# Altium project segment_driver_large.PrjPcb
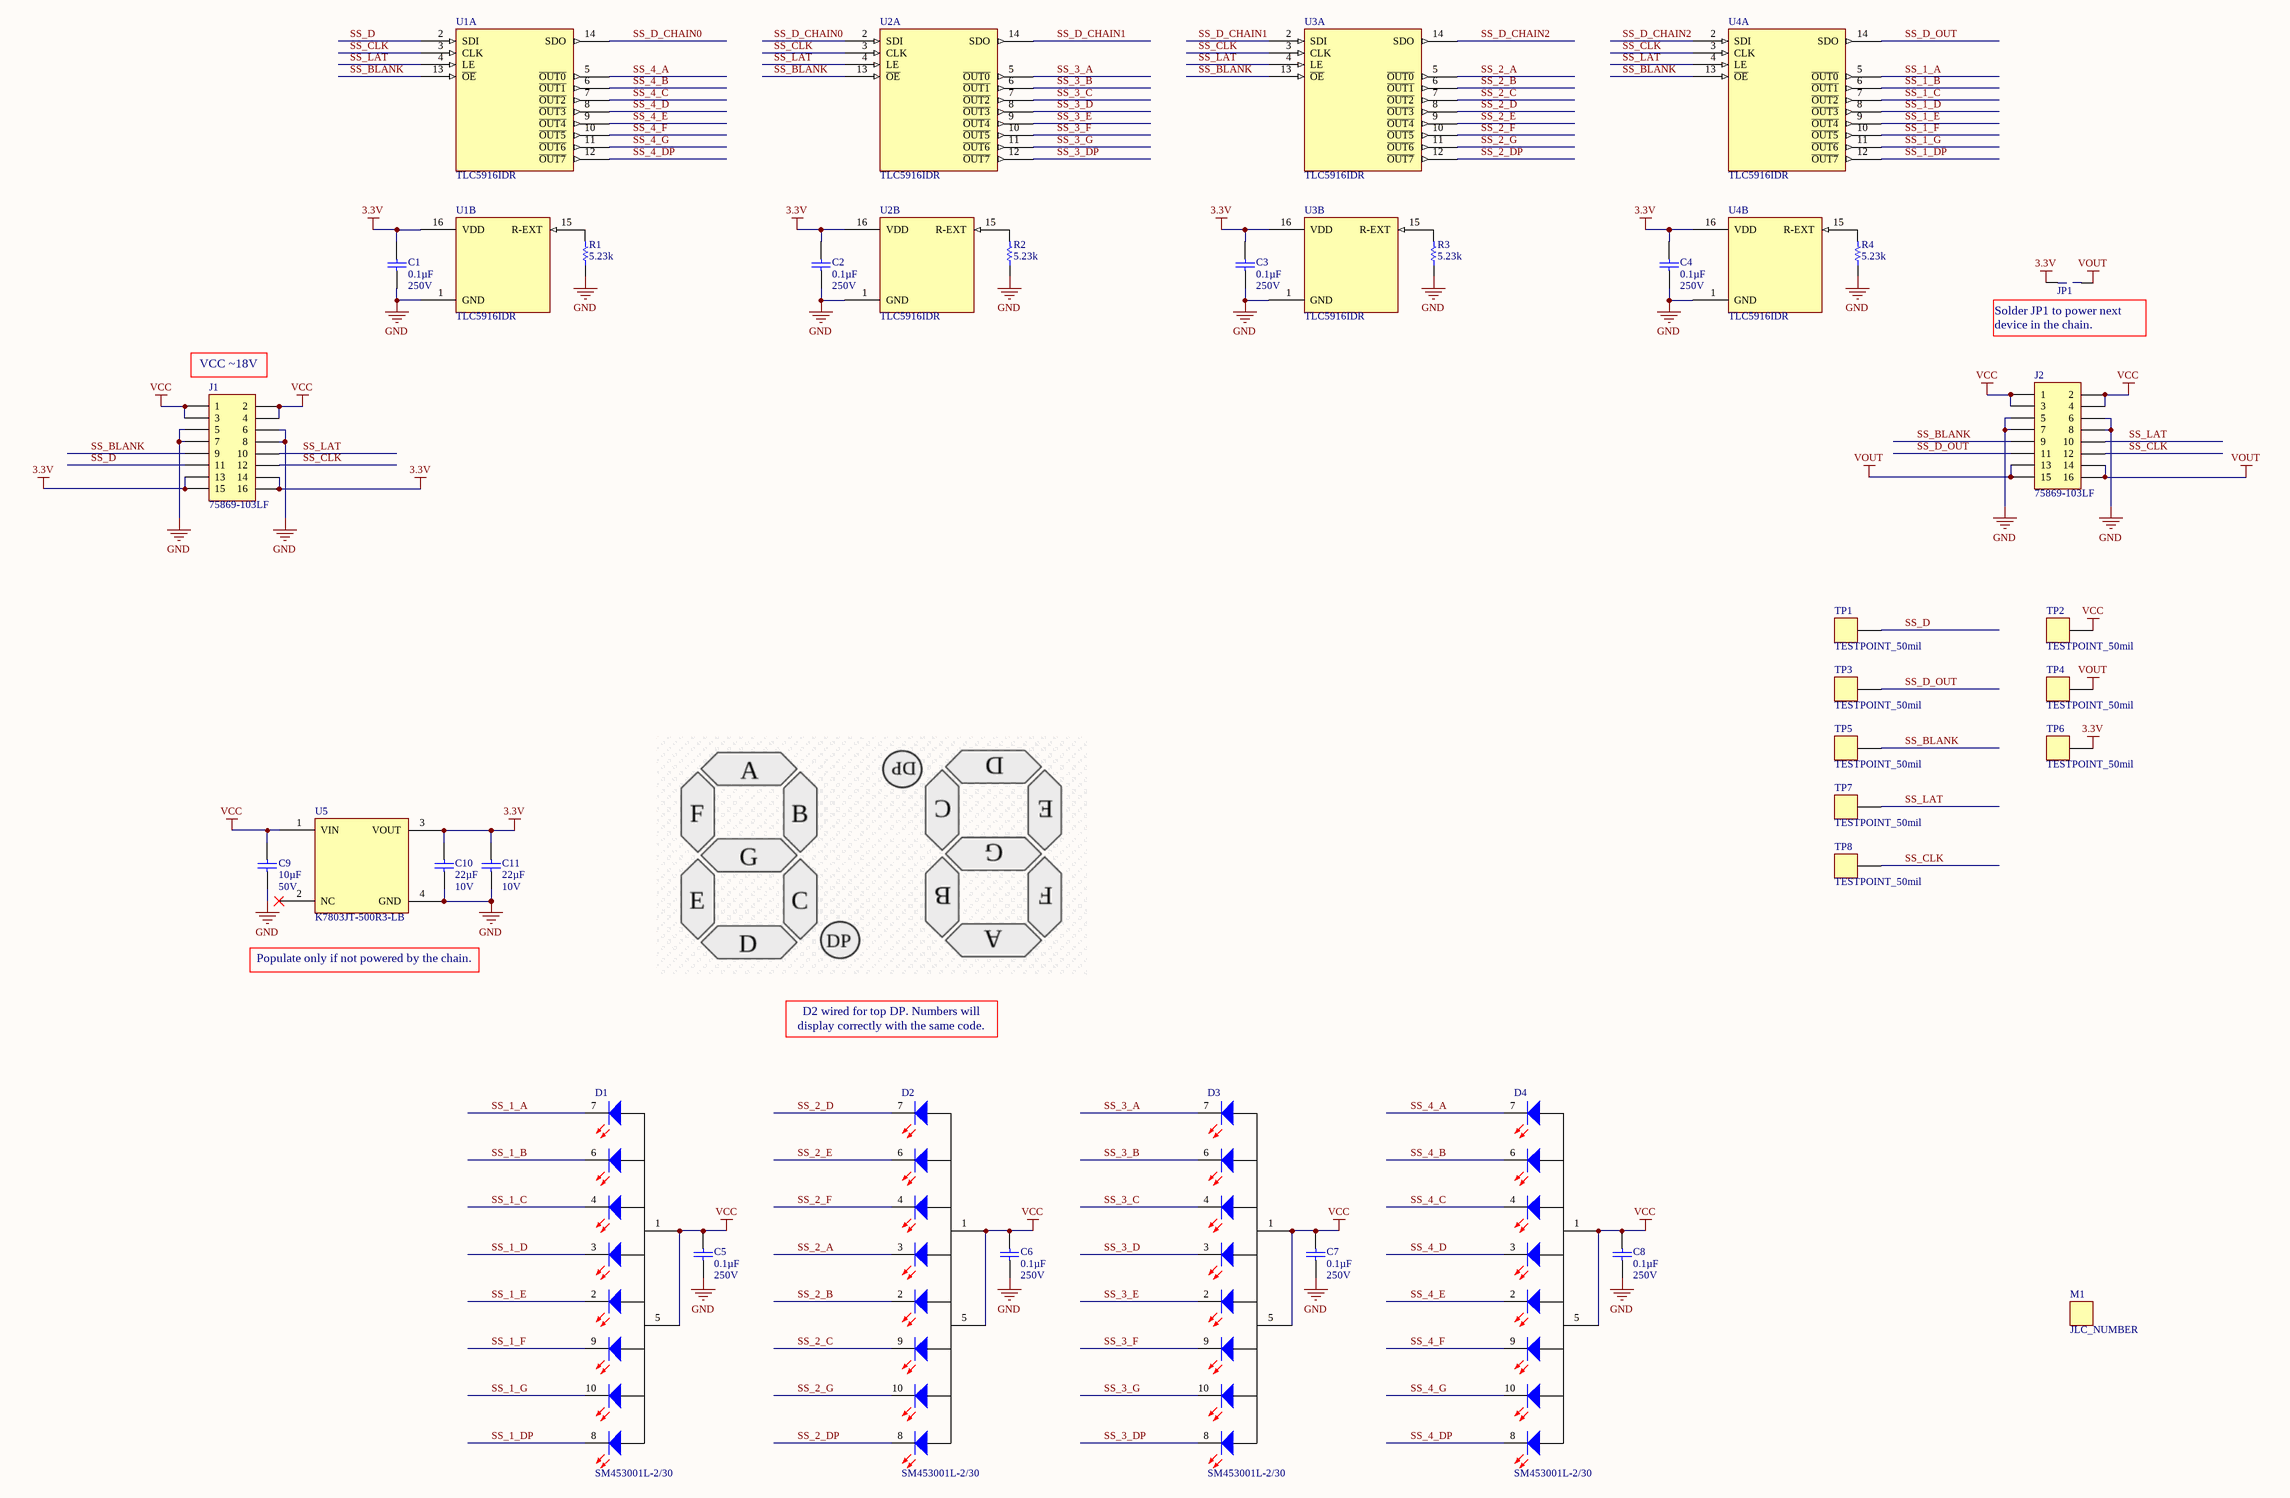
[diagram p0: segment_driver_large.SchDoc]
LeadEngineer: JCF; HardRev: A; Codename: 3 Inch Segment Driver; BOMRev: A
1 sheet, 36 parts. Net scope: global (net labels, ports and power ports of the same name join across sheets).
Board file: segment_driver_large.PcbDoc

## Sheet segment_driver_large.SchDoc
size C; SheetNumber: 1; SheetTotal: 1

### Parts
C1  0.1µF  Voltage: 250V  [Chip0805]
C2  0.1µF  Voltage: 250V  [Chip0805]
C3  0.1µF  Voltage: 250V  [Chip0805]
C4  0.1µF  Voltage: 250V  [Chip0805]
C5  0.1µF  Voltage: 250V  [Chip0805]
C6  0.1µF  Voltage: 250V  [Chip0805]
C7  0.1µF  Voltage: 250V  [Chip0805]
C8  0.1µF  Voltage: 250V  [Chip0805]
C9  10µF  Voltage: 50V  [Chip1206]
C10  22µF  Voltage: 10V  [Chip0805]
C11  22µF  Voltage: 10V  [Chip0805]
D1  SM453001L-2/30  [ARKLED_SM453001L]
D2  SM453001L-2/30  [ARKLED_SM453001L]
D3  SM453001L-2/30  [ARKLED_SM453001L]
D4  SM453001L-2/30  [ARKLED_SM453001L]
J1  75869-103LF  [IDC_100_2x8]
J2  75869-103LF  [IDC_100_2x8]
JP1  JUMMPER_NO_CIRCLE  [JUMMPER_NO_CIRCLE]  (value not drawn)  (no BOM)
M1  JLC_NUMBER  [JLC_NUMBER]  (no BOM)
R1  5.23k  [Chip0805]
R2  5.23k  [Chip0805]
R3  5.23k  [Chip0805]
R4  5.23k  [Chip0805]
TP1  TESTPOINT_50mil  [TESTPOINT_50mil]  (no BOM)
TP2  TESTPOINT_50mil  [TESTPOINT_50mil]  (no BOM)
TP3  TESTPOINT_50mil  [TESTPOINT_50mil]  (no BOM)
TP4  TESTPOINT_50mil  [TESTPOINT_50mil]  (no BOM)
TP5  TESTPOINT_50mil  [TESTPOINT_50mil]  (no BOM)
TP6  TESTPOINT_50mil  [TESTPOINT_50mil]  (no BOM)
TP7  TESTPOINT_50mil  [TESTPOINT_50mil]  (no BOM)
TP8  TESTPOINT_50mil  [TESTPOINT_50mil]  (no BOM)
U1  TLC5916IDR  [16-SOIC]  (parts A,B of 2)
U2  TLC5916IDR  [16-SOIC]  (parts A,B of 2)
U3  TLC5916IDR  [16-SOIC]  (parts A,B of 2)
U4  TLC5916IDR  [16-SOIC]  (parts A,B of 2)
U5  K7803JT-500R3-LB  [MORNSUN_K78XXJT-500R3-LB]

### Nets
3.3V: C1.2 C2.2 C3.2 C4.2 C10.2 C11.2 J1.13 J1.14 J1.15 J1.16 JP1.2 TP6.1 U1.16(VDD) U2.16(VDD) U3.16(VDD) U4.16(VDD) U5.3(VOUT)
GND: C1.1 C2.1 C3.1 C4.1 C5.1 C6.1 C7.1 C8.1 C9.1 C10.1 C11.1 J1.5 J1.6 J1.7 J1.8 J2.5 J2.6 J2.7 J2.8 R1.1 R2.1 R3.1 R4.1 U1.1(GND) U2.1(GND) U3.1(GND) U4.1(GND) U5.4(GND)
VCC: C5.2 C6.2 C7.2 C8.2 C9.2 D1.1(A) D1.5(A) D2.1(A) D2.5(A) D3.1(A) D3.5(A) D4.1(A) D4.5(A) J1.1 J1.2 J1.3 J1.4 J2.1 J2.2 J2.3 J2.4 TP2.1 U5.1(VIN)
VOUT: J2.13 J2.14 J2.15 J2.16 JP1.1 TP4.1
SS_1_A: D1.7(A) U4.5(~{OUT0})
SS_1_B: D1.6(B) U4.6(~{OUT1})
SS_1_C: D1.4(C) U4.7(~{OUT2})
SS_1_D: D1.3(D) U4.8(~{OUT3})
SS_1_DP: D1.8(DP) U4.12(~{OUT7})
SS_1_E: D1.2(E) U4.9(~{OUT4})
SS_1_F: D1.9(F) U4.10(~{OUT5})
SS_1_G: D1.10(G) U4.11(~{OUT6})
SS_2_A: D2.3(D) U3.5(~{OUT0})
SS_2_B: D2.2(E) U3.6(~{OUT1})
SS_2_C: D2.9(F) U3.7(~{OUT2})
SS_2_D: D2.7(A) U3.8(~{OUT3})
SS_2_DP: D2.8(DP) U3.12(~{OUT7})
SS_2_E: D2.6(B) U3.9(~{OUT4})
SS_2_F: D2.4(C) U3.10(~{OUT5})
SS_2_G: D2.10(G) U3.11(~{OUT6})
SS_3_A: D3.7(A) U2.5(~{OUT0})
SS_3_B: D3.6(B) U2.6(~{OUT1})
SS_3_C: D3.4(C) U2.7(~{OUT2})
SS_3_D: D3.3(D) U2.8(~{OUT3})
SS_3_DP: D3.8(DP) U2.12(~{OUT7})
SS_3_E: D3.2(E) U2.9(~{OUT4})
SS_3_F: D3.9(F) U2.10(~{OUT5})
SS_3_G: D3.10(G) U2.11(~{OUT6})
SS_4_A: D4.7(A) U1.5(~{OUT0})
SS_4_B: D4.6(B) U1.6(~{OUT1})
SS_4_C: D4.4(C) U1.7(~{OUT2})
SS_4_D: D4.3(D) U1.8(~{OUT3})
SS_4_DP: D4.8(DP) U1.12(~{OUT7})
SS_4_E: D4.2(E) U1.9(~{OUT4})
SS_4_F: D4.9(F) U1.10(~{OUT5})
SS_4_G: D4.10(G) U1.11(~{OUT6})
SS_BLANK: J1.9 J2.9 TP5.1 U1.13(~{OE}) U2.13(~{OE}) U3.13(~{OE}) U4.13(~{OE})
SS_CLK: J1.12 J2.12 TP8.1 U1.3(CLK) U2.3(CLK) U3.3(CLK) U4.3(CLK)
SS_D: J1.11 TP1.1 U1.2(SDI)
SS_D_CHAIN0: U1.14(SDO) U2.2(SDI)
SS_D_CHAIN1: U2.14(SDO) U3.2(SDI)
SS_D_CHAIN2: U3.14(SDO) U4.2(SDI)
SS_D_OUT: J2.11 TP3.1 U4.14(SDO)
SS_LAT: J1.10 J2.10 TP7.1 U1.4(LE) U2.4(LE) U3.4(LE) U4.4(LE)
NetR1_2: R1.2 U1.15(R-EXT)
NetR2_2: R2.2 U2.15(R-EXT)
NetR3_2: R3.2 U3.15(R-EXT)
NetR4_2: R4.2 U4.15(R-EXT)

Not connected (* = marked no-connect by the designer): U5 2(NC)*

### Notes on the sheet
- (near JP1) Solder JP1 to power next device in the chain.
- (near J1) VCC ~18V
- Populate only if not powered by the chain.
- D2 wired for top DP. Numbers will display correctly with the same code.
- Title:
- This work is licensed under a Creative Commons Attribution 4.0 International License. Derivative works should remove all Sophistry branding and ‘é’ watermark.
- Date:
- Engineer:
- Revision:
- Codename:
- Time:
- Variant:
- Sheet
- of

### Library data of the parts
C1-C8 = C2012X7T2E104K125AA: CAP CER 0.1UF 250V 10% X7T 0805; Manufacturer: TDK Corporation; PartNumber: C2012X7T2E104K125AA; HelpURL: http://product.tdk.com/capacitor/mlcc/en/documents/mlcc_commercial_midvoltage_en.pdf; Supplier 1: Digi-Key; Supplier Part Number 1: 445-7749-1-ND; Supplier 2: Mouser; Manufacturer Part Number: C2012X7T2E104K125AA; Series: C; Capacitance: 0.1µF; Tolerance: ±10%; Temperature Coefficient: X7T; Mounting Type: Surface Mount, MLCC; Operating Temperature: -55°C ~ 125°C; Applications: General Purpose; Ratings: -; Package / Case: 0805 (2012 Metric); Size / Dimension: 0.079" L x 0.049" W (2.00mm x 1.25mm); Height - Seated (Max): -; Thickness (Max): 0.057" (1.45mm); Lead Spacing: -; Features: -; Lead Style: -
C9 = C3216X5R1H106K160AB: CAP CER 10UF 50V 10% X5R 1206; Manufacturer: TDK Corporation; PartNumber: C3216X5R1H106K160AB; HelpURL: http://product.tdk.com/capacitor/mlcc/en/documents/mlcc_commercial_general_en.pdf; Supplier 1: Digi-Key; Supplier Part Number 1: 445-5998-1-ND; Supplier 2: Mouser; Manufacturer Part Number: C3216X5R1H106K160AB; Series: C; Capacitance: 10µF; Tolerance: ±10%; Temperature Coefficient: X5R; Mounting Type: Surface Mount, MLCC; Operating Temperature: -55°C ~ 85°C; Applications: General Purpose; Ratings: -; Package / Case: 1206 (3216 Metric); Size / Dimension: 0.126" L x 0.063" W (3.20mm x 1.60mm); Height - Seated (Max): -; Thickness (Max): 0.071" (1.80mm); Lead Spacing: -; Features: -; Lead Style: -
C10 C11 = C2012X5R1A226M085AC: CAP CER 22UF 10V 20% X5R 0805; Manufacturer: TDK Corporation; PartNumber: C2012X5R1A226M085AC; HelpURL: http://product.tdk.com/capacitor/mlcc/en/documents/mlcc_commercial_general_en.pdf; Supplier 1: Digi-Key; Supplier Part Number 1: 445-7663-1-ND; Supplier 2: Mouser; Manufacturer Part Number: C2012X5R1A226M085AC; Series: C; Capacitance: 22µF; Tolerance: ±20%; Temperature Coefficient: X5R; Mounting Type: Surface Mount, MLCC; Operating Temperature: -55°C ~ 85°C; Applications: General Purpose; Ratings: -; Package / Case: 0805 (2012 Metric); Size / Dimension: 0.079" L x 0.049" W (2.00mm x 1.25mm); Height - Seated (Max): -; Thickness (Max): 0.037" (0.95mm); Lead Spacing: -; Features: -; Lead Style: -
D1-D4 = SM453001L-2/30: SEGMENTS DISPLAY 3.0" COMMON ANODE; Manufacturer: ARKLED; PartNumber: SM453001L-2/30; Datasheets: https://www.lcsc.com/datasheet/lcsc_datasheet_2405201814_ARKLED-Wuxi-ARK-Tech-Elec-SM453001L-2-30_C164873.pdf; Supplier 1: Digi-Key; Supplier 2: Mouser; Supplier 3: LCSC; Supplier Part Number 3: C164873; Manufacturer Part Number: SM453001L-2/30
J1 J2 = 75869-103LF: CONN HEADER 16POS DUAL VERT PCB; Manufacturer: FCI; PartNumber: 75869-103LF; Supplier 1: Digi-Key; Supplier 2: Mouser; Supplier Part Number 2: 649-75869-103LF; HelpURL: http://portal.fciconnect.com/Comergent//fci/drawing/75869.pdf; Supplier Part Number 1: 609-1775-ND; Manufacturer Part Number: 75869-103LF
M1 = JLC_NUMBER: JLC Order Number Location; PartNumber: JLC_NUMBER; Manufacturer Part Number: JLC_NUMBER
R1-R4 = CRCW08055K23FKEA: RES 5.23K OHM 1/8W 1% 0805 SMD; Manufacturer: Vishay Dale; Power (Watts): 0.125W, 1/8W; Temperature Coefficient: ±100ppm/°C; PartNumber: CRCW08055K23FKEA; HelpURL: http://www.vishay.com/doc?20035; Supplier 1: Digi-Key; Supplier Part Number 1: 541-5.23KCCT-ND; Supplier 2: Mouser; Manufacturer Part Number: CRCW08055K23FKEA; Series: CRCW; Resistance: 5.23k; Tolerance: ±1%; Composition: Thick Film; Features: Automotive AEC-Q200 Qualified; Package / Case: 0805 (2012 Metric); Supplier Device Package: 0805 (2012 Metric); Size / Dimension: 0.079" L x 0.049" W (2.00mm x 1.25mm); Height: 0.020" (0.50mm); Number of Terminations: 2
U1-U4 = TLC5916IDR: IC LED DRVR LINEAR 120MA 16SOIC; Manufacturer: Texas Instruments; PartNumber: TLC5916IDR; Supplier 1: Digi-Key; Supplier 2: Mouser; Supplier Part Number 2: 595-TLC5916IDR; HelpURL: https://www.ti.com/lit/ds/symlink/tlc5916.pdf; Supplier Part Number 1: 296-22710-2-ND; Manufacturer Part Number: TLC5916IDR
U5 = K7803JT-500R3-LB: LINEAR REGULATOR REPLACEMENT DC; Manufacturer: Mornsun America, LLC; PartNumber: K7803JT-500R3-LB; HelpURL: https://www.mornsun-power.com/html/pdf/K7803JT-500R3-LB.html; Supplier 1: Digi-Key; Supplier Part Number 1: 2725-K7803JT-500R3-LBCT-ND; Manufacturer Part Number: K7803JT-500R3-LB
JP1 = JUMMPER_NO_CIRCLE: PartNumber: JUMMPER_NO_CIRCLE; Manufacturer Part Number: JUMMPER_NO_CIRCLE
TP1-TP8 = TESTPOINT_50mil: PartNumber: TESTPOINT_50mil; Manufacturer Part Number: TESTPOINT_50mil